# Altium project PROC154E3_SCH.PrjPcb (part 30 of 60)

## Sheet 32. USB 3.0 TYPE A CONN#1.SchDoc: USB 3.0 TYPE-A CONNECTORS - 1
size 513 x 386 mm; Project: PROC154E2(001)_SK_AM69; Issue: 1.0; RevCode: E3; Page Create Date: March  8, 1995; Variant Name: Core Design; Schematic Page Number: 32; Page Number: 32; Page Size: C; Comment: MISTRAL_TITLEBLK_CSIZE_1; Page Count: 62; Schematic Page Count: 62; Name: PROC154E2 001 SK AM69; DsnPath: C:\Users\danie\Downloads\sprr466c\PROC154E3_RP\PROC154E3_SCH.DSN; SchematicName: SCHEMATIC1; PageName: 32. USB 3.0 TYPE A CONN#1; PageSize: C; TopSchematic: True
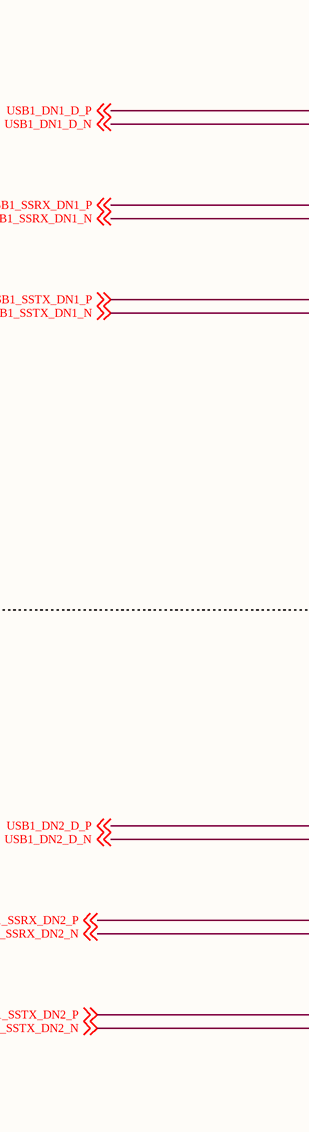
[diagram p51: 32. USB 3.0 TYPE A CONN#1.SchDoc, left]
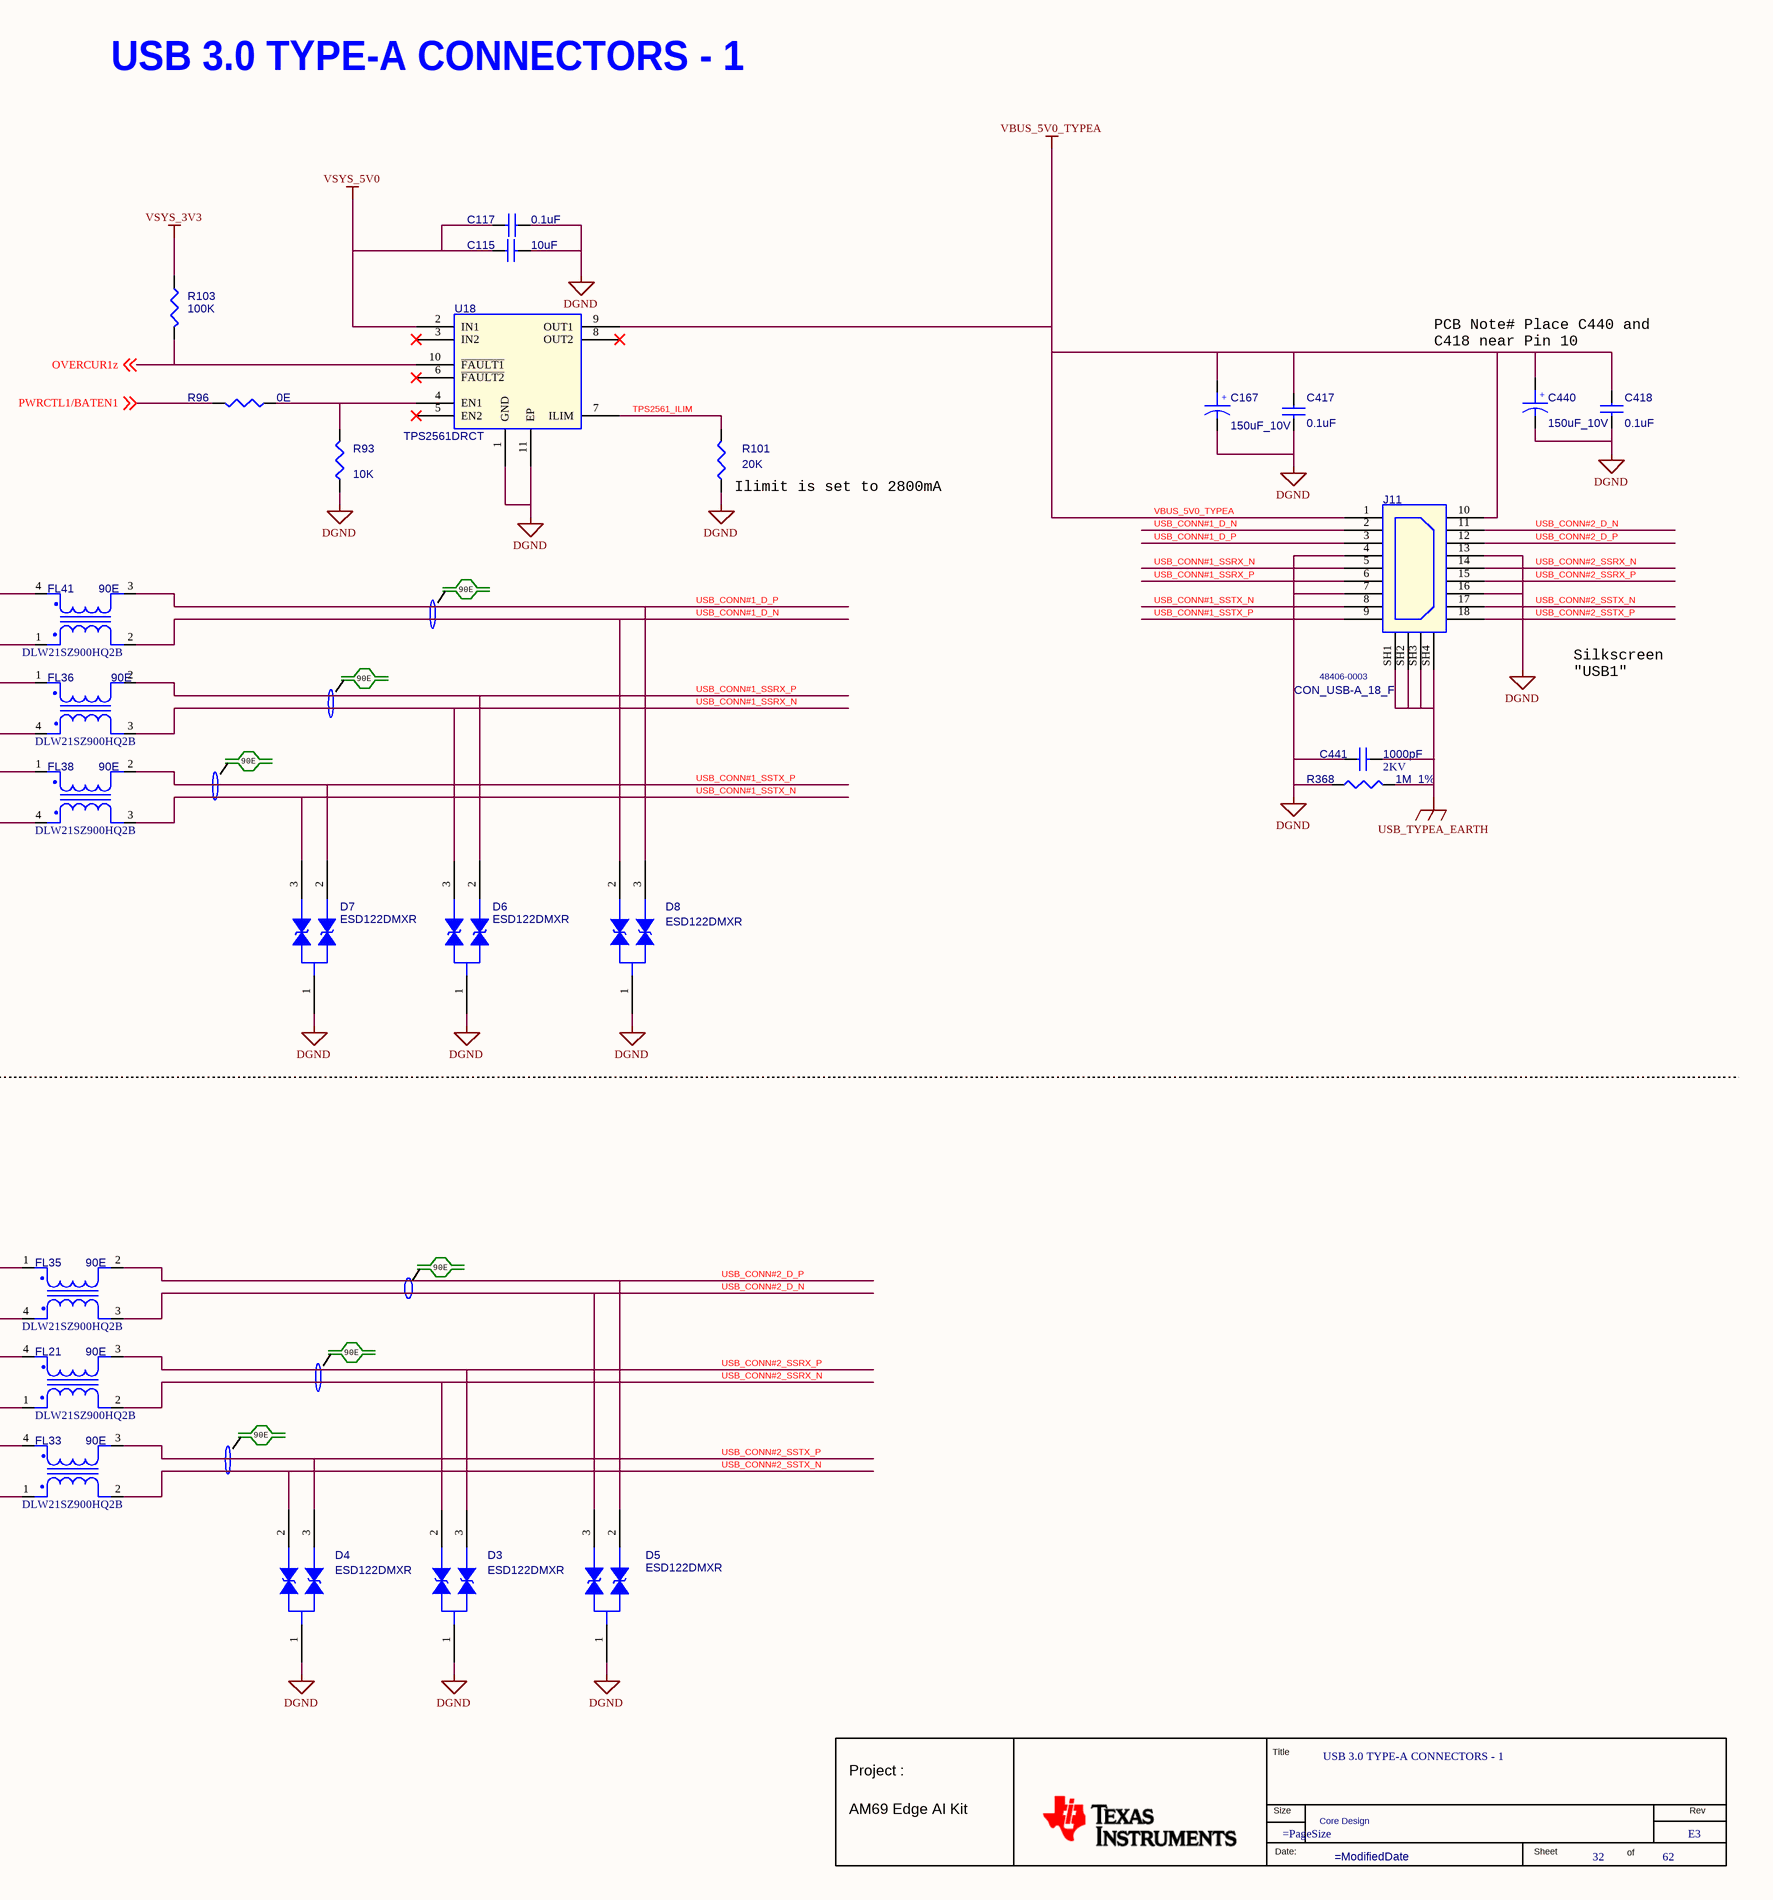
[diagram p52: 32. USB 3.0 TYPE A CONN#1.SchDoc, right]

### Parts
(Parts that share a designator on the sheet are numbered #1, #2 ... from top to bottom, then left to right.)
*#32  RevCode: E3  Title: USB 3.0 TYPE-A CONNECTORS - 1  Page Number: 32  Page Count: 62  Variant Name: Core Design  (hidden comment: MISTRAL_TITLEBLK_CSIZE_1)  (graphical)
C115  10uF  [CAP0603_1]
C117  0.1uF  [CAP0201_0-5]
C167  150uF_10V  [CAPT3528B_2-25]
C417  0.1uF  [CAP0201_0-5]
C418  0.1uF  [CAP0201_0-5]
C440  150uF_10V  [CAPT3528B_2-25]
C441  1000pF  Voltage: 2KV  [CAP1206_1-5]
D3  ESD122DMXR  [X2SON3_ESD122DMX_30X40_0-4]
D4  ESD122DMXR  [X2SON3_ESD122DMX_30X40_0-4]
D5  ESD122DMXR  [X2SON3_ESD122DMX_30X40_0-4]
D6  ESD122DMXR  [X2SON3_ESD122DMX_30X40_0-4]
D7  ESD122DMXR  [X2SON3_ESD122DMX_30X40_0-4]
D8  ESD122DMXR  [X2SON3_ESD122DMX_30X40_0-4]
FL21  90E  Mfr_part_number: DLW21SZ900HQ2B  [IND4_DLW21H_90X60_SMD_1-4]
FL33  90E  Mfr_part_number: DLW21SZ900HQ2B  [IND4_DLW21H_90X60_SMD_1-4]
FL35  90E  Mfr_part_number: DLW21SZ900HQ2B  [IND4_DLW21H_90X60_SMD_1-4]
FL36  90E  Mfr_part_number: DLW21SZ900HQ2B  [IND4_DLW21H_90X60_SMD_1-4]
FL38  90E  Mfr_part_number: DLW21SZ900HQ2B  [IND4_DLW21H_90X60_SMD_1-4]
FL41  90E  Mfr_part_number: DLW21SZ900HQ2B  [IND4_DLW21H_90X60_SMD_1-4]
J11  CON_USB-A_18_F  Mfr_part_number: 48406-0003  [CON_USBA18_48406_S_R_T_15-7]
R93  10K  [RES0201_0-5]
R96  0E  [RES0402_0-5]
R101  20K  [RES0402_0-5]
R103  100K  [RES0402_0-5]
R368  1M_1%  [RES0805_0-75]
U18  TPS2561DRCT  [VSON10_TPS74801-Q1_120X120_1]

### Nets
DGND: C115.2 C117.1 C167.2 C417.2 C418.2 C440.2 C441.1 D3.1(GND) D4.1(GND) D5.1(GND) D6.1(GND) D7.1(GND) D8.1(GND) J11.4(GND_1) J11.7(GND_DRAIN_1) J11.13(GND_2) J11.16(GND_DRAIN_2) R93.1 R101.1 R368.1 U18.1(GND) U18.11(EP)  [project net VDD_CPU_HCPS_GOSNS]
USB_TYPEA_EARTH: C441.2 J11.SH1 J11.SH2 J11.SH3 J11.SH4 R368.2
VBUS_5V0_TYPEA: C167.1 C417.1 C418.1 C440.1 J11.1(VBUS_1) J11.10(VBUS_2) U18.9(OUT1)
VSYS_3V3: R103.1  [project net V_3V3]
VSYS_5V0: C115.1 C117.2 U18.2(IN1)
OVERCUR1z: R103.2 U18.10(~{FAULT1}) ; off-sheet OVERCUR1z
PWRCTL1/BATEN1: R96.2 ; off-sheet PWRCTL1/BATEN1
TPS2561_ILIM: R101.2 U18.7(ILIM)
USB1_DN1_D_N: FL41.1(IN1) ; off-sheet USB1_DN1_D_N
USB1_DN1_D_P: FL41.4(OUT2) ; off-sheet USB1_DN1_D_P
USB1_DN2_D_N: FL35.4(OUT2) ; off-sheet USB1_DN2_D_N
USB1_DN2_D_P: FL35.1(IN1) ; off-sheet USB1_DN2_D_P
USB1_SSRX_DN1_N: FL36.4(OUT2) ; off-sheet USB1_SSRX_DN1_N
USB1_SSRX_DN1_P: FL36.1(IN1) ; off-sheet USB1_SSRX_DN1_P
USB1_SSRX_DN2_N: FL21.1(IN1) ; off-sheet USB1_SSRX_DN2_N
USB1_SSRX_DN2_P: FL21.4(OUT2) ; off-sheet USB1_SSRX_DN2_P
USB1_SSTX_DN1_N: FL38.4(OUT2) ; off-sheet USB1_SSTX_DN1_N
USB1_SSTX_DN1_P: FL38.1(IN1) ; off-sheet USB1_SSTX_DN1_P
USB1_SSTX_DN2_N: FL33.1(IN1) ; off-sheet USB1_SSTX_DN2_N
USB1_SSTX_DN2_P: FL33.4(OUT2) ; off-sheet USB1_SSTX_DN2_P
USB_CONN#1_D_N: D8.2(IO1) FL41.2(IN2) J11.2(D-_1)
USB_CONN#1_D_P: D8.3(IO2) FL41.3(OUT1) J11.3(D+_1)
USB_CONN#1_SSRX_N: D6.3(IO2) FL36.3(OUT1) J11.5(STDA_SSRX-_1)
USB_CONN#1_SSRX_P: D6.2(IO1) FL36.2(IN2) J11.6(STDA_SSRX+_1)
USB_CONN#1_SSTX_N: D7.3(IO2) FL38.3(OUT1) J11.8(STDA_SSTX-_1)
USB_CONN#1_SSTX_P: D7.2(IO1) FL38.2(IN2) J11.9(STDA_SSTX+_1)
USB_CONN#2_D_N: D5.3(IO2) FL35.3(OUT1) J11.11(D-_2)
USB_CONN#2_D_P: D5.2(IO1) FL35.2(IN2) J11.12(D+_2)
USB_CONN#2_SSRX_N: D3.2(IO1) FL21.2(IN2) J11.14(STDA_SSRX-_2)
USB_CONN#2_SSRX_P: D3.3(IO2) FL21.3(OUT1) J11.15(STDA_SSRX+_2)
USB_CONN#2_SSTX_N: D4.2(IO1) FL33.2(IN2) J11.17(STDA_SSTX-_2)
USB_CONN#2_SSTX_P: D4.3(IO2) FL33.3(OUT1) J11.18(STDA_SSTX+_2)
NetR93_2: R93.2 R96.1 U18.4(EN1)

Not connected (* = marked no-connect by the designer): U18 3(IN2)* 5(EN2)* 6(~{FAULT2})* 8(OUT2)*

### Notes on the sheet
- USB 3.0 TYPE-A CONNECTORS - 1
- PCB Note# Place C440 and
  C418 near Pin 10
- (near R101) Ilimit is set to 2800mA
- 90E
- Silkscreen
  "USB1"
- (in symbol CAP_POL) +
- (in symbol MISTRAL_TITLEBLK_CSIZE_1) Title; Project :; Size; Rev; AM69 Edge AI Kit; Date:; Sheet; of

### Library data of the parts
*#32 = MISTRAL_TITLEBLK_CSIZE_1: as *#31 on sheet 31. USB HUB; Page Create Date: March  8, 1995; Page Size: =PageSize; Page Modify Date: =ModifiedDate; Schematic Page Count: 62; Schematic Page Number: 32
C115 = CAP_Dup1: CAP CERAMIC 10uF 16V 20% X6S 0603; Part Reference: C115; Mistral Part No: 120022090023-R; Mfr_name: TAIYO YUDEN; Mfr_part_number: EMK107BC6106MA-T; Part_type: CAPACITORS\CERAMIC; Project: J7AHP_SK_BRD; Wattage: NA; Customs_HS_Code: 85322990; Custom_Duty: 15%; Value: 10uF; PCB Footprint: CAP0603_1; Footprint Ref: CAP0603_1; Tolerance: 20%; Voltage: 16V; Package: 0603; Distributor_name: DIGIKEY; Distributor_part_number: 587-4867-1-ND; Library Ref: CAP; Height: 1.00MM; Weight: NA; Temperature: -55°C+105°C; Datasheet: Y:\MIS_DATABASE\DATASHEETS\CAPACITORS\EMK107BC6106MA-T.PDF; Crtd /date: PRAVEEN/160922; Chkd/date: PRAVEEN/160922; MECHANICAL 3D STEP FILE: CAP0603_1; Library Path: Y:\MIS_DATABASE\Library\ALTIUM_TOOL\SCHEMATICS_PARTS\MS_DISCRETE_Library.schlib; Footprint Path: Y:\MIS_DATABASE\Library\ALTIUM_TOOL\PCB_FOOTPRINTS\Altium_Footprint_Lib.PcbLib
C117 = CAP_Dup1: CAP CERAMIC 0.1uF 16V 10% X7S AUTO 0201; Part Reference: C117; Mistral Part No: 120021030007-R; Mfr_name: MURATA; Mfr_part_number: GRT033C71C104KE01D; Part_type: CAPACITORS\CERAMIC; Project: J7ES_SK_BRD; Wattage: NA; Customs_HS_Code: 85322990; Custom_Duty: 15%; Value: 0.1uF; PCB Footprint: CAP0201_0-5; Tolerance: 10%; Voltage: 16V; Package: 0201; Distributor_name: DIGIKEY; Distributor_part_number: 490-GRT033C71C104KE01DTR-ND; Height: 0.33MM; Weight: 330mg; Temperature: -55°C+125°C; Datasheet: Y:\MIS_DATABASE\DATASHEETS\CAPACITORS\GRT033C71C104KE01.PDF; Crtd /date: ALVY/110321; Chkd/date: MANIRAJA/110321; MECHANICAL 3D STEP FILE: CAP0201_0-5
C167 = CAP_POL: CAP TANTALUM 150uF 10V 20% ESR 500mE B3528; Part Reference: C167; Mistral Part No: 120015050001-R; Mfr_name: AVX CORPORATION; Mfr_part_number: TLJB157M010R0500; Part_type: CAPACITORS\TANTALUM; Project: MED CARD; Wattage: NA; Customs_HS_Code: 85322990; Custom_Duty: 15%; Value: 150uF_10V; Tolerance: 20%; Voltage: 10V; Package: B3528; Distributor_name: DIGIKEY; Distributor_part_number: 478-3349-1-ND; Library Ref: CAP_POL; Height: 2.10MM; Weight: NA; Temperature: -55°C+125°C; Datasheet: Y:\MIS_DATABASE\DATASHEETS\CAPACITORS\TLJ_SERIES.PDF; Crtd /date: VASANTHA/040515; Chkd/date: NAVEED/060515; MECHANICAL 3D STEP FILE: CAPT3528B_2-25; Footprint Ref: CAPT3528B_2-25; Library Path: Y:\MIS_DATABASE\Library\ALTIUM_TOOL\SCHEMATICS_PARTS\MS_DISCRETE_Library.schlib; Footprint Path: Y:\MIS_DATABASE\Library\ALTIUM_TOOL\PCB_FOOTPRINTS\Altium_Footprint_Lib.PcbLib; PCB Footprint: CAPT3528B_2-25
C417 = CAP_Dup1: CAP CERAMIC 0.1uF 16V 10% X7S AUTO 0201; Part Reference: C417; Mistral Part No: 120021030007-R; Mfr_name: MURATA; Mfr_part_number: GRT033C71C104KE01D; Part_type: CAPACITORS\CERAMIC; Project: J7ES_SK_BRD; Wattage: NA; Customs_HS_Code: 85322990; Custom_Duty: 15%; Value: 0.1uF; Tolerance: 10%; Voltage: 16V; Package: 0201; Distributor_name: DIGIKEY; Distributor_part_number: 490-GRT033C71C104KE01DTR-ND; Height: 0.33MM; Weight: 330mg; Temperature: -55°C+125°C; Datasheet: Y:\MIS_DATABASE\DATASHEETS\CAPACITORS\GRT033C71C104KE01.PDF; Crtd /date: ALVY/110321; Chkd/date: MANIRAJA/110321; MECHANICAL 3D STEP FILE: CAP0201_0-5; PCB Footprint: CAP0201_0-5
C418 = CAP_Dup1: CAP CERAMIC 0.1uF 16V 10% X7S AUTO 0201; Part Reference: C418; Mistral Part No: 120021030007-R; Mfr_name: MURATA; Mfr_part_number: GRT033C71C104KE01D; Part_type: CAPACITORS\CERAMIC; Project: J7ES_SK_BRD; Wattage: NA; Customs_HS_Code: 85322990; Custom_Duty: 15%; Value: 0.1uF; Tolerance: 10%; Voltage: 16V; Package: 0201; Distributor_name: DIGIKEY; Distributor_part_number: 490-GRT033C71C104KE01DTR-ND; Height: 0.33MM; Weight: 330mg; Temperature: -55°C+125°C; Datasheet: Y:\MIS_DATABASE\DATASHEETS\CAPACITORS\GRT033C71C104KE01.PDF; Crtd /date: ALVY/110321; Chkd/date: MANIRAJA/110321; MECHANICAL 3D STEP FILE: CAP0201_0-5; PCB Footprint: CAP0201_0-5
C440 = CAP_POL: CAP TANTALUM 150uF 10V 20% ESR 500mE B3528; Part Reference: C440; Part_type: CAPACITORS\TANTALUM; Mfr_part_number: TLJB157M010R0500; Mfr_name: AVX CORPORATION; Mistral Part No: 120015050001-R; Custom_Duty: 15%; Customs_HS_Code: 85322990; Wattage: NA; Project: MED CARD; Value: 150uF_10V; Footprint Path: Y:\MIS_DATABASE\Library\ALTIUM_TOOL\PCB_FOOTPRINTS\Altium_Footprint_Lib.PcbLib; Library Path: Y:\MIS_DATABASE\Library\ALTIUM_TOOL\SCHEMATICS_PARTS\MS_DISCRETE_Library.schlib; Footprint Ref: CAPT3528B_2-25; MECHANICAL 3D STEP FILE: CAPT3528B_2-25; Chkd/date: NAVEED/060515; Crtd /date: VASANTHA/040515; Datasheet: Y:\MIS_DATABASE\DATASHEETS\CAPACITORS\TLJ_SERIES.PDF; Temperature: -55°C+125°C; Weight: NA; Height: 2.10MM; Library Ref: CAP_POL; Distributor_part_number: 478-3349-1-ND; Distributor_name: DIGIKEY; Package: B3528; Voltage: 10V; Tolerance: 20%; PCB Footprint: CAPT3528B_2-25
C441 = CAP_Dup1: CAP CERAMIC 1000pF 2KV 10% X7R 1206; Part Reference: C441; Automotive Alternate_mfr_part_number: C1206X102KGRACAUTO; Automotive Alternate_mfr_name: KEMET; Direct Alternate_mfr_part_number: C1206C102KGRACTU; Part_type: CAPACITORS\CERAMIC; Mistral Part No: 120015110005-R; Wattage: NA; Custom_Duty: 15%; Customs_HS_Code: 85322990; Project: MANTIS_1.0_BRD; Value: 1000pF; Direct Alternate_mfr_name: KEMET; MECHANICAL 3D STEP FILE: CAP1206_1-5; Chkd/date: MANIRAJA/111219; Crtd /date: ALVY/111219; Datasheet: Y:\MIS_DATABASE\DATASHEETS\CAPACITORS\KEMET-C-X7R-HV.PDF; Temperature: -55°C+125°C; Weight: 16.2mg; Height: 1.35MM; Distributor_part_number: 399-4819-1-ND; Distributor_name: DIGIKEY; Package: 1206; Tolerance: 10%; Mfr_part_number: C1206C102KGRACTU; Mfr_name: KEMET; Library Ref: CAP; Footprint Ref: CAP1206_1-5; Library Path: Y:\MIS_DATABASE\Library\ALTIUM_TOOL\SCHEMATICS_PARTS\MS_DISCRETE_Library.schlib; Footprint Path: Y:\MIS_DATABASE\Library\ALTIUM_TOOL\PCB_FOOTPRINTS\Altium_Footprint_Lib.PcbLib; PCB Footprint: CAP1206_1-5
D3 = DIODE_ESD122DMXR: DIODE 2-CH ESD PROTECTION FOR USB TYPE-C AND HDMI 2.0 X2SON-3; Part Reference: D3; Part_type: DIODE\TVS; Mfr_name: TEXAS INSTRUMENTS; Mistral Part No: 130017080015-R; Custom_Duty: 15%; Customs_HS_Code: 85412900; Wattage: NA; Project: TI_SVB_CONTROLLER CARD; Value: ESD122DMXR; PCB Footprint: X2SON3_ESD122DMX_30X40_0-4; MECHANICAL 3D STEP FILE: X2SON3_ESD122DMX_30X40_0-4; Chkd/date: MANIRAJA/140817; Crtd /date: MANIRAJA/140817; Datasheet: Y:\MIS_DATABASE\DATASHEETS\DISCRETES\DIODES\ESD122XX.PDF; Temperature: -40°C+125°C; Weight: NA; Height: 0.40MM; Library Ref: DIODE_ESD122DMXR; Distributor_part_number: ESD122DMXR-ND; Distributor_name: DIGIKEY; Package: X2SON-3; Voltage: NA; Tolerance: NA; Mfr_part_number: ESD122DMXR
D4 = DIODE_ESD122DMXR: DIODE 2-CH ESD PROTECTION FOR USB TYPE-C AND HDMI 2.0 X2SON-3; Part Reference: D4; Mistral Part No: 130017080015-R; Mfr_name: TEXAS INSTRUMENTS; Part_type: DIODE\TVS; Project: TI_SVB_CONTROLLER CARD; Tolerance: NA; Customs_HS_Code: 85412900; Custom_Duty: 15%; Value: ESD122DMXR; PCB Footprint: X2SON3_ESD122DMX_30X40_0-4; Mfr_part_number: ESD122DMXR; Voltage: NA; Wattage: NA; Package: X2SON-3; Distributor_name: DIGIKEY; Distributor_part_number: ESD122DMXR-ND; Library Ref: DIODE_ESD122DMXR; Height: 0.40MM; Weight: NA; Temperature: -40°C+125°C; Datasheet: Y:\MIS_DATABASE\DATASHEETS\DISCRETES\DIODES\ESD122XX.PDF; Crtd /date: MANIRAJA/140817; Chkd/date: MANIRAJA/140817; MECHANICAL 3D STEP FILE: X2SON3_ESD122DMX_30X40_0-4
D5 = DIODE_ESD122DMXR: DIODE 2-CH ESD PROTECTION FOR USB TYPE-C AND HDMI 2.0 X2SON-3; Part Reference: D5; Part_type: DIODE\TVS; Mfr_name: TEXAS INSTRUMENTS; Mistral Part No: 130017080015-R; Custom_Duty: 15%; Customs_HS_Code: 85412900; Wattage: NA; Project: TI_SVB_CONTROLLER CARD; Value: ESD122DMXR; MECHANICAL 3D STEP FILE: X2SON3_ESD122DMX_30X40_0-4; Chkd/date: MANIRAJA/140817; Crtd /date: MANIRAJA/140817; Datasheet: Y:\MIS_DATABASE\DATASHEETS\DISCRETES\DIODES\ESD122XX.PDF; Temperature: -40°C+125°C; Weight: NA; Height: 0.40MM; Library Ref: DIODE_ESD122DMXR; Distributor_part_number: ESD122DMXR-ND; Distributor_name: DIGIKEY; Package: X2SON-3; Voltage: NA; Tolerance: NA; Mfr_part_number: ESD122DMXR; PCB Footprint: X2SON3_ESD122DMX_30X40_0-4
D6 = DIODE_ESD122DMXR: DIODE 2-CH ESD PROTECTION FOR USB TYPE-C AND HDMI 2.0 X2SON-3; Part Reference: D6; Mistral Part No: 130017080015-R; Mfr_name: TEXAS INSTRUMENTS; Part_type: DIODE\TVS; Project: TI_SVB_CONTROLLER CARD; Tolerance: NA; Customs_HS_Code: 85412900; Custom_Duty: 15%; Value: ESD122DMXR; Mfr_part_number: ESD122DMXR; Voltage: NA; Wattage: NA; Package: X2SON-3; Distributor_name: DIGIKEY; Distributor_part_number: ESD122DMXR-ND; Library Ref: DIODE_ESD122DMXR; Height: 0.40MM; Weight: NA; Temperature: -40°C+125°C; Datasheet: Y:\MIS_DATABASE\DATASHEETS\DISCRETES\DIODES\ESD122XX.PDF; Crtd /date: MANIRAJA/140817; Chkd/date: MANIRAJA/140817; MECHANICAL 3D STEP FILE: X2SON3_ESD122DMX_30X40_0-4; PCB Footprint: X2SON3_ESD122DMX_30X40_0-4
D7 = DIODE_ESD122DMXR: DIODE 2-CH ESD PROTECTION FOR USB TYPE-C AND HDMI 2.0 X2SON-3; Part Reference: D7; Part_type: DIODE\TVS; Mfr_name: TEXAS INSTRUMENTS; Mistral Part No: 130017080015-R; Custom_Duty: 15%; Customs_HS_Code: 85412900; Wattage: NA; Project: TI_SVB_CONTROLLER CARD; Value: ESD122DMXR; MECHANICAL 3D STEP FILE: X2SON3_ESD122DMX_30X40_0-4; Chkd/date: MANIRAJA/140817; Crtd /date: MANIRAJA/140817; Datasheet: Y:\MIS_DATABASE\DATASHEETS\DISCRETES\DIODES\ESD122XX.PDF; Temperature: -40°C+125°C; Weight: NA; Height: 0.40MM; Library Ref: DIODE_ESD122DMXR; Distributor_part_number: ESD122DMXR-ND; Distributor_name: DIGIKEY; Package: X2SON-3; Voltage: NA; Tolerance: NA; Mfr_part_number: ESD122DMXR; PCB Footprint: X2SON3_ESD122DMX_30X40_0-4
D8 = DIODE_ESD122DMXR: DIODE 2-CH ESD PROTECTION FOR USB TYPE-C AND HDMI 2.0 X2SON-3; Part Reference: D8; Part_type: DIODE\TVS; Mfr_name: TEXAS INSTRUMENTS; Mistral Part No: 130017080015-R; Custom_Duty: 15%; Customs_HS_Code: 85412900; Wattage: NA; Project: TI_SVB_CONTROLLER CARD; Value: ESD122DMXR; PCB Footprint: X2SON3_ESD122DMX_30X40_0-4; MECHANICAL 3D STEP FILE: X2SON3_ESD122DMX_30X40_0-4; Chkd/date: MANIRAJA/140817; Crtd /date: MANIRAJA/140817; Datasheet: Y:\MIS_DATABASE\DATASHEETS\DISCRETES\DIODES\ESD122XX.PDF; Temperature: -40°C+125°C; Weight: NA; Height: 0.40MM; Library Ref: DIODE_ESD122DMXR; Distributor_part_number: ESD122DMXR-ND; Distributor_name: DIGIKEY; Package: X2SON-3; Voltage: NA; Tolerance: NA; Mfr_part_number: ESD122DMXR
FL21 = INDUCTOR_DLW31S: IND COMMON MODE CHOKE 90E 280mA SMD; Part Reference: FL21; Mistral Part No: 130019060035-R; Mfr_name: MURATA; Project: TI_J7ES_CP; Tolerance: NA; Customs_HS_Code: 85437099; Custom_Duty: 24%; SIGNAL_MODEL: INDUCTOR_DLW31S_IND4_DLW21H_90X_90E; Value: 90E; PCB Footprint: IND4_DLW21H_90X60_SMD_1-4; Footprint Ref: IND4_DLW21H_90X60_SMD_1-4; Part_type: INDUCTOR; Voltage: NA; Wattage: NA; Package: SMD; Distributor_name: NA; Distributor_part_number: NA; Library Ref: INDUCTOR_DLW31S; Height: 1.40MM; Weight: 11mg; Temperature: -40°C+105°C; Datasheet: Y:\MIS_DATABASE\DATASHEETS\DISCRETES\INDUCTORS\DLW21SZ900HQ2B.PDF; Crtd /date: MANIRAJA/270619; Chkd/date: MANIRAJA/270619; MECHANICAL 3D STEP FILE: IND4_DLW21H_90X60_SMD_1-4; Library Path: Y:\MIS_DATABASE\Library\ALTIUM_TOOL\SCHEMATICS_PARTS\MS_DISCRETE_Library.schlib; Footprint Path: Y:\MIS_DATABASE\Library\ALTIUM_TOOL\PCB_FOOTPRINTS\Altium_Footprint_Lib.PcbLib
FL33 = INDUCTOR_DLW31S: IND COMMON MODE CHOKE 90E 280mA SMD; Part Reference: FL33; Mistral Part No: 130019060035-R; Mfr_name: MURATA; Project: TI_J7ES_CP; Tolerance: NA; Customs_HS_Code: 85437099; Custom_Duty: 24%; SIGNAL_MODEL: INDUCTOR_DLW31S_IND4_DLW21H_90X_90E; Value: 90E; PCB Footprint: IND4_DLW21H_90X60_SMD_1-4; Footprint Ref: IND4_DLW21H_90X60_SMD_1-4; Part_type: INDUCTOR; Voltage: NA; Wattage: NA; Package: SMD; Distributor_name: NA; Distributor_part_number: NA; Library Ref: INDUCTOR_DLW31S; Height: 1.40MM; Weight: 11mg; Temperature: -40°C+105°C; Datasheet: Y:\MIS_DATABASE\DATASHEETS\DISCRETES\INDUCTORS\DLW21SZ900HQ2B.PDF; Crtd /date: MANIRAJA/270619; Chkd/date: MANIRAJA/270619; MECHANICAL 3D STEP FILE: IND4_DLW21H_90X60_SMD_1-4; Library Path: Y:\MIS_DATABASE\Library\ALTIUM_TOOL\SCHEMATICS_PARTS\MS_DISCRETE_Library.schlib; Footprint Path: Y:\MIS_DATABASE\Library\ALTIUM_TOOL\PCB_FOOTPRINTS\Altium_Footprint_Lib.PcbLib
FL35 = INDUCTOR_DLW31S: IND COMMON MODE CHOKE 90E 280mA SMD; Part Reference: FL35; Mfr_name: MURATA; Mistral Part No: 130019060035-R; Custom_Duty: 24%; Customs_HS_Code: 85437099; Wattage: NA; Project: TI_J7ES_CP; SIGNAL_MODEL: INDUCTOR_DLW31S_IND4_DLW21H_90X_90E; Value: 90E; PCB Footprint: IND4_DLW21H_90X60_SMD_1-4; Footprint Path: Y:\MIS_DATABASE\Library\ALTIUM_TOOL\PCB_FOOTPRINTS\Altium_Footprint_Lib.PcbLib; Library Path: Y:\MIS_DATABASE\Library\ALTIUM_TOOL\SCHEMATICS_PARTS\MS_DISCRETE_Library.schlib; MECHANICAL 3D STEP FILE: IND4_DLW21H_90X60_SMD_1-4; Chkd/date: MANIRAJA/270619; Crtd /date: MANIRAJA/270619; Datasheet: Y:\MIS_DATABASE\DATASHEETS\DISCRETES\INDUCTORS\DLW21SZ900HQ2B.PDF; Temperature: -40°C+105°C; Weight: 11mg; Height: 1.40MM; Library Ref: INDUCTOR_DLW31S; Distributor_part_number: NA; Distributor_name: NA; Package: SMD; Voltage: NA; Tolerance: NA; Part_type: INDUCTOR; Footprint Ref: IND4_DLW21H_90X60_SMD_1-4
FL36 = INDUCTOR_DLW31S: IND COMMON MODE CHOKE 90E 280mA SMD; Part Reference: FL36; Mfr_name: MURATA; Mistral Part No: 130019060035-R; Custom_Duty: 24%; Customs_HS_Code: 85437099; Wattage: NA; Project: TI_J7ES_CP; SIGNAL_MODEL: INDUCTOR_DLW31S_IND4_DLW21H_90X_90E; Value: 90E; PCB Footprint: IND4_DLW21H_90X60_SMD_1-4; Footprint Path: Y:\MIS_DATABASE\Library\ALTIUM_TOOL\PCB_FOOTPRINTS\Altium_Footprint_Lib.PcbLib; Library Path: Y:\MIS_DATABASE\Library\ALTIUM_TOOL\SCHEMATICS_PARTS\MS_DISCRETE_Library.schlib; MECHANICAL 3D STEP FILE: IND4_DLW21H_90X60_SMD_1-4; Chkd/date: MANIRAJA/270619; Crtd /date: MANIRAJA/270619; Datasheet: Y:\MIS_DATABASE\DATASHEETS\DISCRETES\INDUCTORS\DLW21SZ900HQ2B.PDF; Temperature: -40°C+105°C; Weight: 11mg; Height: 1.40MM; Library Ref: INDUCTOR_DLW31S; Distributor_part_number: NA; Distributor_name: NA; Package: SMD; Voltage: NA; Tolerance: NA; Part_type: INDUCTOR; Footprint Ref: IND4_DLW21H_90X60_SMD_1-4
FL38 = INDUCTOR_DLW31S: IND COMMON MODE CHOKE 90E 280mA SMD; Part Reference: FL38; Mfr_name: MURATA; Mistral Part No: 130019060035-R; Custom_Duty: 24%; Customs_HS_Code: 85437099; Wattage: NA; Project: TI_J7ES_CP; SIGNAL_MODEL: INDUCTOR_DLW31S_IND4_DLW21H_90X_90E; Value: 90E; PCB Footprint: IND4_DLW21H_90X60_SMD_1-4; Footprint Path: Y:\MIS_DATABASE\Library\ALTIUM_TOOL\PCB_FOOTPRINTS\Altium_Footprint_Lib.PcbLib; Library Path: Y:\MIS_DATABASE\Library\ALTIUM_TOOL\SCHEMATICS_PARTS\MS_DISCRETE_Library.schlib; MECHANICAL 3D STEP FILE: IND4_DLW21H_90X60_SMD_1-4; Chkd/date: MANIRAJA/270619; Crtd /date: MANIRAJA/270619; Datasheet: Y:\MIS_DATABASE\DATASHEETS\DISCRETES\INDUCTORS\DLW21SZ900HQ2B.PDF; Temperature: -40°C+105°C; Weight: 11mg; Height: 1.40MM; Library Ref: INDUCTOR_DLW31S; Distributor_part_number: NA; Distributor_name: NA; Package: SMD; Voltage: NA; Tolerance: NA; Part_type: INDUCTOR; Footprint Ref: IND4_DLW21H_90X60_SMD_1-4
FL41 = INDUCTOR_DLW31S: IND COMMON MODE CHOKE 90E 280mA SMD; Part Reference: FL41; Mistral Part No: 130019060035-R; Mfr_name: MURATA; Project: TI_J7ES_CP; Tolerance: NA; Customs_HS_Code: 85437099; Custom_Duty: 24%; SIGNAL_MODEL: INDUCTOR_DLW31S_IND4_DLW21H_90X_90E; Value: 90E; PCB Footprint: IND4_DLW21H_90X60_SMD_1-4; Footprint Ref: IND4_DLW21H_90X60_SMD_1-4; Part_type: INDUCTOR; Voltage: NA; Wattage: NA; Package: SMD; Distributor_name: NA; Distributor_part_number: NA; Library Ref: INDUCTOR_DLW31S; Height: 1.40MM; Weight: 11mg; Temperature: -40°C+105°C; Datasheet: Y:\MIS_DATABASE\DATASHEETS\DISCRETES\INDUCTORS\DLW21SZ900HQ2B.PDF; Crtd /date: MANIRAJA/270619; Chkd/date: MANIRAJA/270619; MECHANICAL 3D STEP FILE: IND4_DLW21H_90X60_SMD_1-4; Library Path: Y:\MIS_DATABASE\Library\ALTIUM_TOOL\SCHEMATICS_PARTS\MS_DISCRETE_Library.schlib; Footprint Path: Y:\MIS_DATABASE\Library\ALTIUM_TOOL\PCB_FOOTPRINTS\Altium_Footprint_Lib.PcbLib
J11 = CON_USB-A_18_4SH: CON USB-A TYPE 18POS FEMALE RT TH; Part Reference: J11; Part_type: CONNECTOR\USB; Mfr_name: MOLEX; Mistral Part No: 150017040004-R; Custom_Duty: 24%; Customs_HS_Code: 85369090; Wattage: NA; Project: AU17; Value: CON_USB-A_18_F; MECHANICAL 3D STEP FILE: CON_USBA18_48406_S_R_T_15-7; Chkd/date: MANIRAJA/050417; Crtd /date: MANIRAJA/310317; Datasheet: Y:\MIS_DATABASE\DATASHEETS\CONNECTORS\48406.PDF; Temperature: -20°C+85°C; Weight: 5.45g; Height: 15.65MM; Library Ref: CON_USB-A_18_4SH; Distributor_part_number: WM10420-ND; Distributor_name: DIGIKEY; Package: THRU-HOLE; Voltage: NA; Tolerance: NA; PCB Footprint: CON_USBA18_48406_S_R_T_15-7
R93 = RESISTOR_Dup2: RES 10K 1/20W 5% 0201; Part Reference: R93; Mistral Part No: 110010070051-R; Mfr_name: YAGEO AMERICA; Mfr_part_number: RC0201JR-0710KL; Part_type: RESISTORS\FIXED; Project: GOLDEN-I LITE; Voltage: NA; Customs_HS_Code: 85332119; Custom_Duty: 15%; Value: 10K; PCB Footprint: RES0201_0-5; Footprint Path: Y:\MIS_DATABASE\Library\ALTIUM_TOOL\PCB_FOOTPRINTS\Altium_Footprint_Lib.PcbLib; Library Path: Y:\MIS_DATABASE\Library\ALTIUM_TOOL\SCHEMATICS_PARTS\MS_DISCRETE_Library.schlib; Footprint Ref: RES0201_0-5; Library Ref: RESISTOR; Tolerance: 5%; Wattage: 1/20W; Package: 0201; Distributor_name: DIGIKEY; Distributor_part_number: 311-10KNCT-ND; Height: 0.26MM; Weight: 0.17mg; Temperature: -55°C+125°C; Datasheet: Y:\MIS_DATABASE\DATASHEETS\RESISTORS\RCXXXXL-SER_MAR18.PDF; Crtd /date: MANIRAJA/050517; Chkd/date: MANIRAJA/050517; MECHANICAL 3D STEP FILE: RES0201_0-5
R96 = RESISTOR_Dup2: RES 0E 1/10W JUMPER 0402; Part Reference: R96; Part_type: RESISTORS\FIXED; Mfr_part_number: ERJ-2GE0R00X; Mfr_name: PANASONIC-ECG; Mistral Part No: 110018030052-R; Custom_Duty: 15%; Customs_HS_Code: 85332119; Voltage: NA; Project: AEGIS POM; Value: 0E; PCB Footprint: RES0402_0-5; Footprint Path: Y:\MIS_DATABASE\Library\ALTIUM_TOOL\PCB_FOOTPRINTS\Altium_Footprint_Lib.PcbLib; Library Path: Y:\MIS_DATABASE\Library\ALTIUM_TOOL\SCHEMATICS_PARTS\MS_DISCRETE_Library.schlib; Footprint Ref: RES0402_0-5; Library Ref: RESISTOR; Chkd/date: VASANTHA/061216; Crtd /date: NAVEED/201014; Datasheet: Y:\MIS_DATABASE\DATASHEETS\RESISTORS\PAN-ERJSER_NOV17.PDF; Temperature: -55°C+155°C; Weight: 0.8mg; Height: 0.40MM; Distributor_part_number: P0.0JCT-ND; Distributor_name: DIGIKEY; Package: 0402; Wattage: 1/10W; Tolerance: NA; MECHANICAL 3D STEP FILE: RES0402_0-5
R101 = RESISTOR_Dup2: RES 20K 1/10W 5% 0402; Part Reference: R101; Mistral Part No: 110009030481-R; Mfr_name: PANASONIC-ECG; Mfr_part_number: ERJ-2GEJ203X; Part_type: RESISTORS\FIXED; Project: G4SLIM; Voltage: NA; Customs_HS_Code: 85332119; Custom_Duty: 15%; Value: 20K; PCB Footprint: RES0402_0-5; Footprint Ref: RES0402_0-5; Tolerance: 5%; Wattage: 1/10W; Package: 0402; Distributor_name: DIGIKEY; Distributor_part_number: P20KJCT-ND; Library Ref: RESISTOR; Height: 0.40MM; Weight: 0.8mg; Temperature: -55°C+155°C; Datasheet: Y:\MIS_DATABASE\DATASHEETS\RESISTORS\PAN-ERJSER_NOV17.PDF; Crtd /date: MAZHAR/140505; Chkd/date: SHREESHAIL/121205; MECHANICAL 3D STEP FILE: RES0402_0-5; Library Path: Y:\MIS_DATABASE\Library\ALTIUM_TOOL\SCHEMATICS_PARTS\MS_DISCRETE_Library.schlib; Footprint Path: Y:\MIS_DATABASE\Library\ALTIUM_TOOL\PCB_FOOTPRINTS\Altium_Footprint_Lib.PcbLib
R103 = RESISTOR_Dup2: RES 100K 1/10W 5% 0402; Part Reference: R103; Part_type: RESISTORS\FIXED; Mfr_part_number: ERJ-2GEJ104X; Mfr_name: PANASONIC-ECG; Mistral Part No: 110009030177-R; Custom_Duty: 15%; Customs_HS_Code: 85332119; Voltage: NA; Project: RED EYE; Value: 100K; PCB Footprint: RES0402_0-5; Footprint Path: Y:\MIS_DATABASE\Library\ALTIUM_TOOL\PCB_FOOTPRINTS\Altium_Footprint_Lib.PcbLib; Library Path: Y:\MIS_DATABASE\Library\ALTIUM_TOOL\SCHEMATICS_PARTS\MS_DISCRETE_Library.schlib; MECHANICAL 3D STEP FILE: RES0402_0-5; Chkd/date: VASANTHA/291216; Crtd /date: GEETHA/190406; Datasheet: Y:\MIS_DATABASE\DATASHEETS\RESISTORS\PAN-ERJSER_NOV17.PDF; Temperature: -55°C+155°C; Weight: 0.8mg; Height: 0.40MM; Library Ref: RESISTOR; Distributor_part_number: P100KJCT-ND; Distributor_name: DIGIKEY; Package: 0402; Wattage: 1/10W; Tolerance: 5%; Footprint Ref: RES0402_0-5
R368 = RESISTOR_Dup2: RES 1M 1/8W 1% 0805; Part Reference: R368; Mistral Part No: 110014100002-R; Mfr_name: PANASONIC-ECG; Mfr_part_number: ERJ-6ENF1004V; Part_type: RESISTORS\FIXED; Project: HUMANWARE_PHOENIX; Voltage: NA; Customs_HS_Code: 85332119; Custom_Duty: 15%; Value: 1M_1%; Footprint Ref: RES0805_0-75; Tolerance: 1%; Wattage: 1/8W; Package: 0805; Distributor_name: DIGIKEY; Distributor_part_number: P1.00MCCT-ND; Library Ref: RESISTOR; Height: 0.70MM; Weight: 4mg; Temperature: -55°C+155°C; Datasheet: Y:\MIS_DATABASE\DATASHEETS\RESISTORS\PAN-ERJSER_NOV17.PDF; Crtd /date: BALACHANDAR/150514; Chkd/date: VASANTHA/150514; MECHANICAL 3D STEP FILE: RES0805_0-75; Library Path: Y:\MIS_DATABASE\Library\ALTIUM_TOOL\SCHEMATICS_PARTS\MS_DISCRETE_Library.schlib; Footprint Path: Y:\MIS_DATABASE\Library\ALTIUM_TOOL\PCB_FOOTPRINTS\Altium_Footprint_Lib.PcbLib; PCB Footprint: RES0805_0-75
U18 = TPS2561_VSON10: IC DUAL CHANNEL PRECISION ADJ CURRENT-LIMITED POWER SWITCH VSON10; Part Reference: U18; Part_type: ICS\POWER\MANAGEMENT; Mfr_name: TEXAS INSTRUMENTS; Mistral Part No: 142021010010-R; Custom_Duty: 15%; Customs_HS_Code: 85423100; Wattage: NA; Project: TI_DRA821 SK EVM BRD; Value: TPS2561DRCT; PCB Footprint: VSON10_TPS74801-Q1_120X120_1; Footprint Path: Y:\MIS_DATABASE\Library\ALTIUM_TOOL\PCB_FOOTPRINTS\Altium_Footprint_Lib.PcbLib; Library Path: Y:\MIS_DATABASE\Library\ALTIUM_TOOL\SCHEMATICS_PARTS\MS_MISCPOWER_Library.schlib; MECHANICAL 3D STEP FILE: VSON10_TPS74801-Q1_120X120_1; Chkd/date: MANIRAJA/180121; Crtd /date: ALVY/180121; Datasheet: Y:\MIS_DATABASE\DATASHEETS\ICS\POWER\TPS2561.PDF; Temperature: -40°C+85°C; Weight: 39.3mg; Height: 1.00MM; Library Ref: TPS2561_VSON10; Distributor_part_number: 296-25548-1-ND; Distributor_name: DIGIKEY; Package: VSON10; Voltage: NA; Tolerance: NA; Mfr_part_number: TPS2561DRCT; Footprint Ref: VSON10_TPS74801-Q1_120X120_1

## Sheet 33. USB 3.0 TYPE A CONN#2.SchDoc: USB 3.0 TYPE-A CONNECTORS - 2
size 513 x 386 mm; Project: PROC154E2(001)_SK_AM69; Issue: 1.0; RevCode: E3; Page Create Date: March  8, 1995; Variant Name: Core Design; Schematic Page Number: 33; Page Number: 33; Page Size: C; Comment: MISTRAL_TITLEBLK_CSIZE_1; Page Count: 62; Schematic Page Count: 62; Name: PROC154E2 001 SK AM69; DsnPath: C:\Users\danie\Downloads\sprr466c\PROC154E3_RP\PROC154E3_SCH.DSN; SchematicName: SCHEMATIC1; PageName: 33. USB 3.0 TYPE A CONN#2; PageSize: C; TopSchematic: True
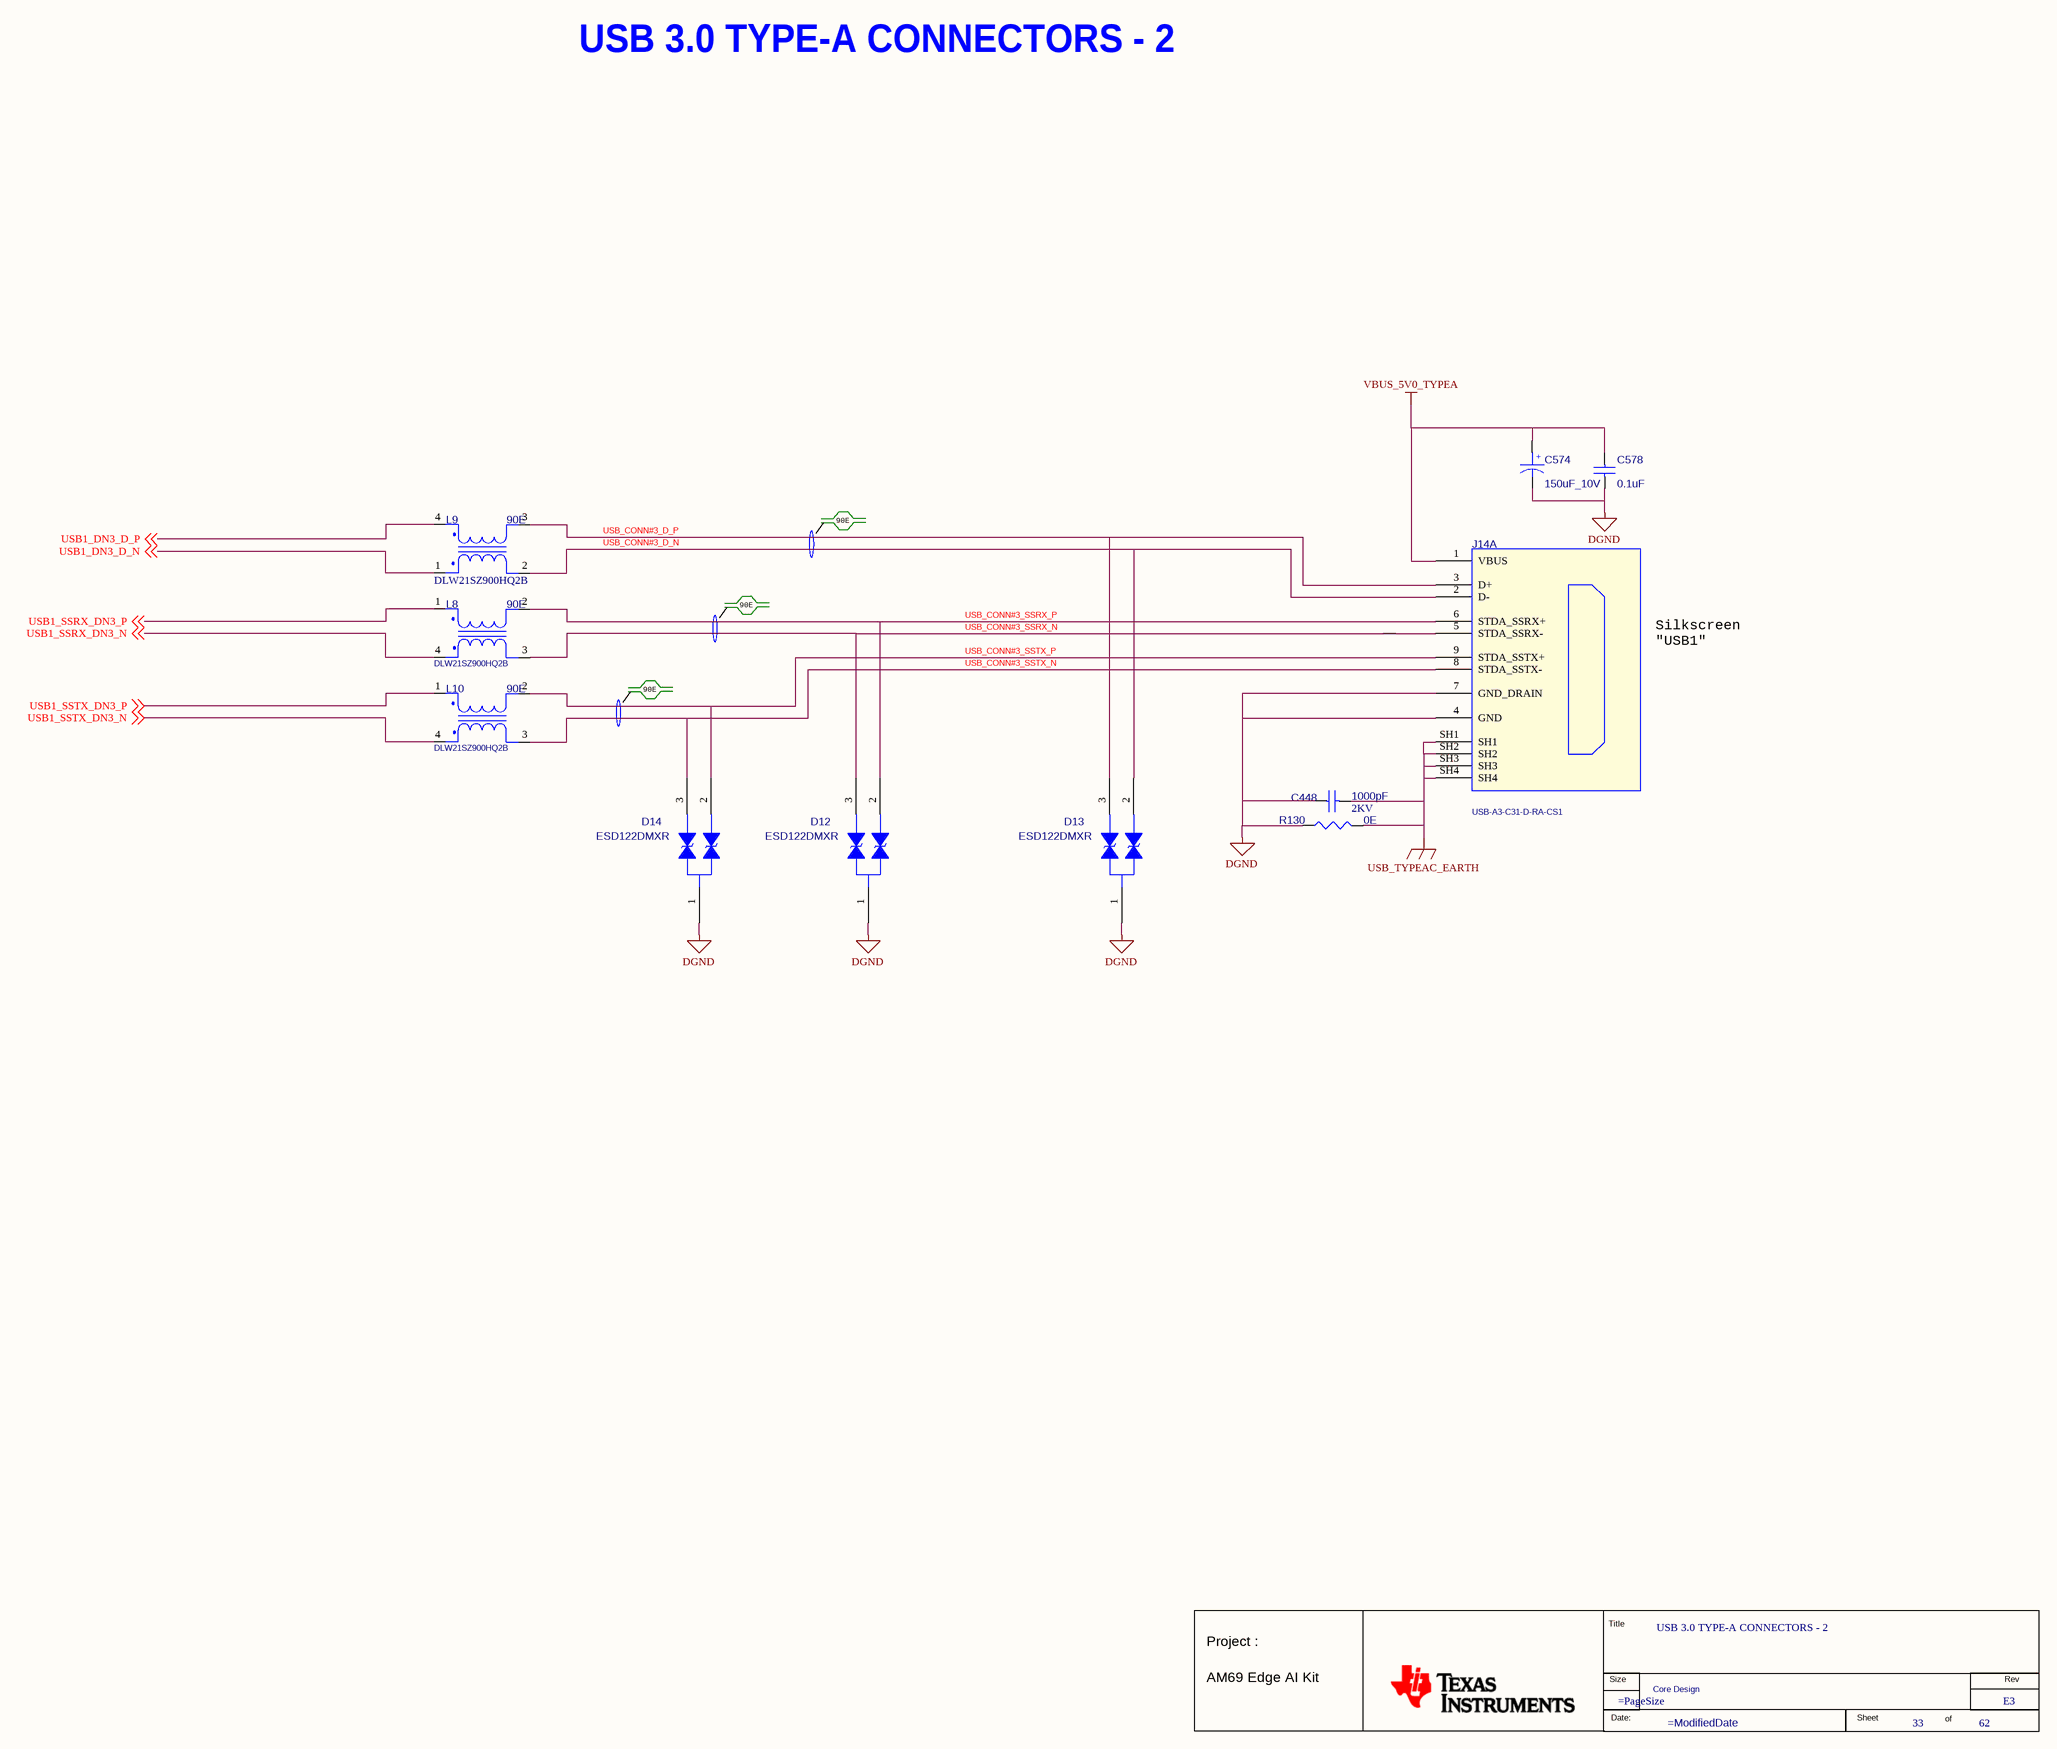
[diagram p53: 33. USB 3.0 TYPE A CONN#2.SchDoc]

### Parts
(Parts that share a designator on the sheet are numbered #1, #2 ... from top to bottom, then left to right.)
*#33  RevCode: E3  Title: USB 3.0 TYPE-A CONNECTORS - 2  Page Number: 33  Page Count: 62  Variant Name: Core Design  (hidden comment: MISTRAL_TITLEBLK_CSIZE_1)  (graphical)
C448  1000pF  Voltage: 2KV  [CAP1206_1-5]
C574  150uF_10V  [CAPT3528B_2-25]
C578  0.1uF  [CAP0201_0-5]
D12  ESD122DMXR  [X2SON3_ESD122DMX_30X40_0-4]
D13  ESD122DMXR  [X2SON3_ESD122DMX_30X40_0-4]
D14  ESD122DMXR  [X2SON3_ESD122DMX_30X40_0-4]
J14  Mfr_part_number: USB-A3-C31-D-RA-CS1  [CON_USBAC33_USB-A3-C31-D-RA-CS1_S_R_T_15-9]  (hidden comment: CON_USB-A9-C24_F)  (part A of 2)
L8  90E  Mfr_part_number: DLW21SZ900HQ2B  [IND4_DLW21H_90X60_SMD_1-4]
L9  90E  Mfr_part_number: DLW21SZ900HQ2B  [IND4_DLW21H_90X60_SMD_1-4]
L10  90E  Mfr_part_number: DLW21SZ900HQ2B  [IND4_DLW21H_90X60_SMD_1-4]
R130  0E  [RES0805_0-75]

### Nets
DGND: C448.1 C574.2 C578.2 D12.1(GND) D13.1(GND) D14.1(GND) J14.4(GND) J14.7(GND_DRAIN) R130.1  [project net VDD_CPU_HCPS_GOSNS]
USB_TYPEAC_EARTH: C448.2 J14.SH1 J14.SH2 J14.SH3 J14.SH4 R130.2
VBUS_5V0_TYPEA: C574.1 C578.1 J14.1(VBUS)
USB1_DN3_D_N: L9.1(IN1) ; off-sheet USB1_DN3_D_N
USB1_DN3_D_P: L9.4(OUT2) ; off-sheet USB1_DN3_D_P
USB1_SSRX_DN3_N: L8.4(OUT2) ; off-sheet USB1_SSRX_DN3_N
USB1_SSRX_DN3_P: L8.1(IN1) ; off-sheet USB1_SSRX_DN3_P
USB1_SSTX_DN3_N: L10.4(OUT2) ; off-sheet USB1_SSTX_DN3_N
USB1_SSTX_DN3_P: L10.1(IN1) ; off-sheet USB1_SSTX_DN3_P
USB_CONN#3_D_N: D13.2(IO1) J14.2(D-) L9.2(IN2)
USB_CONN#3_D_P: D13.3(IO2) J14.3(D+) L9.3(OUT1)
USB_CONN#3_SSRX_N: D12.3(IO2) J14.5(STDA_SSRX-) L8.3(OUT1)
USB_CONN#3_SSRX_P: D12.2(IO1) J14.6(STDA_SSRX+) L8.2(IN2)
USB_CONN#3_SSTX_N: D14.3(IO2) J14.8(STDA_SSTX-) L10.3(OUT1)
USB_CONN#3_SSTX_P: D14.2(IO1) J14.9(STDA_SSTX+) L10.2(IN2)

### Notes on the sheet
- USB 3.0 TYPE-A CONNECTORS - 2
- 90E
- Silkscreen
  "USB1"
- (in symbol CAP_POL) +
- (in symbol MISTRAL_TITLEBLK_CSIZE_1) Title; Project :; Size; Rev; AM69 Edge AI Kit; Date:; Sheet; of

### Library data of the parts
*#33 = MISTRAL_TITLEBLK_CSIZE_1: as *#31 on sheet 31. USB HUB; Page Create Date: March  8, 1995; Page Size: =PageSize; Page Modify Date: =ModifiedDate; Schematic Page Count: 62; Schematic Page Number: 33
C448 = CAP_Dup1: CAP CERAMIC 1000pF 2KV 10% X7R 1206; Part Reference: C448; Automotive Alternate_mfr_part_number: C1206X102KGRACAUTO; Automotive Alternate_mfr_name: KEMET; Direct Alternate_mfr_part_number: C1206C102KGRACTU; Part_type: CAPACITORS\CERAMIC; Mistral Part No: 120015110005-R; Wattage: NA; Custom_Duty: 15%; Customs_HS_Code: 85322990; Project: MANTIS_1.0_BRD; Value: 1000pF; PCB Footprint: CAP1206_1-5; Direct Alternate_mfr_name: KEMET; MECHANICAL 3D STEP FILE: CAP1206_1-5; Chkd/date: MANIRAJA/111219; Crtd /date: ALVY/111219; Datasheet: Y:\MIS_DATABASE\DATASHEETS\CAPACITORS\KEMET-C-X7R-HV.PDF; Temperature: -55°C+125°C; Weight: 16.2mg; Height: 1.35MM; Distributor_part_number: 399-4819-1-ND; Distributor_name: DIGIKEY; Package: 1206; Tolerance: 10%; Mfr_part_number: C1206C102KGRACTU; Mfr_name: KEMET; Library Ref: CAP; Footprint Ref: CAP1206_1-5; Library Path: Y:\MIS_DATABASE\Library\ALTIUM_TOOL\SCHEMATICS_PARTS\MS_DISCRETE_Library.schlib; Footprint Path: Y:\MIS_DATABASE\Library\ALTIUM_TOOL\PCB_FOOTPRINTS\Altium_Footprint_Lib.PcbLib
C574 = CAP_POL: CAP TANTALUM 150uF 10V 20% ESR 500mE B3528; Part Reference: C574; Mistral Part No: 120015050001-R; Mfr_name: AVX CORPORATION; Mfr_part_number: TLJB157M010R0500; Part_type: CAPACITORS\TANTALUM; Project: MED CARD; Wattage: NA; Customs_HS_Code: 85322990; Custom_Duty: 15%; Value: 150uF_10V; PCB Footprint: CAPT3528B_2-25; Tolerance: 20%; Voltage: 10V; Package: B3528; Distributor_name: DIGIKEY; Distributor_part_number: 478-3349-1-ND; Library Ref: CAP_POL; Height: 2.10MM; Weight: NA; Temperature: -55°C+125°C; Datasheet: Y:\MIS_DATABASE\DATASHEETS\CAPACITORS\TLJ_SERIES.PDF; Crtd /date: VASANTHA/040515; Chkd/date: NAVEED/060515; MECHANICAL 3D STEP FILE: CAPT3528B_2-25; Footprint Ref: CAPT3528B_2-25; Library Path: Y:\MIS_DATABASE\Library\ALTIUM_TOOL\SCHEMATICS_PARTS\MS_DISCRETE_Library.schlib; Footprint Path: Y:\MIS_DATABASE\Library\ALTIUM_TOOL\PCB_FOOTPRINTS\Altium_Footprint_Lib.PcbLib
C578 = CAP_Dup1: CAP CERAMIC 0.1uF 16V 10% X7S AUTO 0201; Part Reference: C578; Part_type: CAPACITORS\CERAMIC; Mfr_part_number: GRT033C71C104KE01D; Mfr_name: MURATA; Mistral Part No: 120021030007-R; Custom_Duty: 15%; Customs_HS_Code: 85322990; Wattage: NA; Project: J7ES_SK_BRD; Value: 0.1uF; PCB Footprint: CAP0201_0-5; MECHANICAL 3D STEP FILE: CAP0201_0-5; Chkd/date: MANIRAJA/110321; Crtd /date: ALVY/110321; Datasheet: Y:\MIS_DATABASE\DATASHEETS\CAPACITORS\GRT033C71C104KE01.PDF; Temperature: -55°C+125°C; Weight: 330mg; Height: 0.33MM; Distributor_part_number: 490-GRT033C71C104KE01DTR-ND; Distributor_name: DIGIKEY; Package: 0201; Voltage: 16V; Tolerance: 10%
D12 = DIODE_ESD122DMXR: DIODE 2-CH ESD PROTECTION FOR USB TYPE-C AND HDMI 2.0 X2SON-3; Part Reference: D12; Part_type: DIODE\TVS; Mfr_name: TEXAS INSTRUMENTS; Mistral Part No: 130017080015-R; Custom_Duty: 15%; Customs_HS_Code: 85412900; Wattage: NA; Project: TI_SVB_CONTROLLER CARD; Value: ESD122DMXR; MECHANICAL 3D STEP FILE: X2SON3_ESD122DMX_30X40_0-4; Chkd/date: MANIRAJA/140817; Crtd /date: MANIRAJA/140817; Datasheet: Y:\MIS_DATABASE\DATASHEETS\DISCRETES\DIODES\ESD122XX.PDF; Temperature: -40°C+125°C; Weight: NA; Height: 0.40MM; Library Ref: DIODE_ESD122DMXR; Distributor_part_number: ESD122DMXR-ND; Distributor_name: DIGIKEY; Package: X2SON-3; Voltage: NA; Tolerance: NA; Mfr_part_number: ESD122DMXR; PCB Footprint: X2SON3_ESD122DMX_30X40_0-4
D13 = DIODE_ESD122DMXR: DIODE 2-CH ESD PROTECTION FOR USB TYPE-C AND HDMI 2.0 X2SON-3; Part Reference: D13; Mistral Part No: 130017080015-R; Mfr_name: TEXAS INSTRUMENTS; Part_type: DIODE\TVS; Project: TI_SVB_CONTROLLER CARD; Tolerance: NA; Customs_HS_Code: 85412900; Custom_Duty: 15%; Value: ESD122DMXR; PCB Footprint: X2SON3_ESD122DMX_30X40_0-4; Mfr_part_number: ESD122DMXR; Voltage: NA; Wattage: NA; Package: X2SON-3; Distributor_name: DIGIKEY; Distributor_part_number: ESD122DMXR-ND; Library Ref: DIODE_ESD122DMXR; Height: 0.40MM; Weight: NA; Temperature: -40°C+125°C; Datasheet: Y:\MIS_DATABASE\DATASHEETS\DISCRETES\DIODES\ESD122XX.PDF; Crtd /date: MANIRAJA/140817; Chkd/date: MANIRAJA/140817; MECHANICAL 3D STEP FILE: X2SON3_ESD122DMX_30X40_0-4
D14 = DIODE_ESD122DMXR: DIODE 2-CH ESD PROTECTION FOR USB TYPE-C AND HDMI 2.0 X2SON-3; Part Reference: D14; Part_type: DIODE\TVS; Mfr_name: TEXAS INSTRUMENTS; Mistral Part No: 130017080015-R; Custom_Duty: 15%; Customs_HS_Code: 85412900; Wattage: NA; Project: TI_SVB_CONTROLLER CARD; Value: ESD122DMXR; MECHANICAL 3D STEP FILE: X2SON3_ESD122DMX_30X40_0-4; Chkd/date: MANIRAJA/140817; Crtd /date: MANIRAJA/140817; Datasheet: Y:\MIS_DATABASE\DATASHEETS\DISCRETES\DIODES\ESD122XX.PDF; Temperature: -40°C+125°C; Weight: NA; Height: 0.40MM; Library Ref: DIODE_ESD122DMXR; Distributor_part_number: ESD122DMXR-ND; Distributor_name: DIGIKEY; Package: X2SON-3; Voltage: NA; Tolerance: NA; Mfr_part_number: ESD122DMXR; PCB Footprint: X2SON3_ESD122DMX_30X40_0-4
J14 = CON_USB-A9-C24_F: CON USB-A TYPE 9POS AND USB-C TYPE 24POS STACKED FEMALE RT TH; Part Reference: J14; Part_type: CONNECTOR\USB; Mfr_name: ADAM TECH; Mistral Part No: 150021020043-R; Custom_Duty: 24%; Customs_HS_Code: 85369090; Wattage: NA; Project: J7ES_SK_BRD; Value: CON_USB-A9-C24_F; PCB Footprint: CON_USBAC33_USB-A3-C31-D-RA-CS1_S_R_T_15-9; Footprint Path: Y:\MIS_DATABASE\Library\ALTIUM_TOOL\PCB_FOOTPRINTS\Altium_Footprint_Lib.PcbLib; Library Path: Y:\MIS_DATABASE\Library\ALTIUM_TOOL\SCHEMATICS_PARTS\MS_CONNECTOR_Library.schlib; MECHANICAL 3D STEP FILE: CON_USBAC33_USB-A3-C31-D-RA-CS1_S_R_T_15-9; Chkd/date: MANIRAJA/110221; Crtd /date: ALVY/110221; Datasheet: Y:\MIS_DATABASE\DATASHEETS\CONNECTORS\USB-A3-C31-D-RA-CS1.PDF; Temperature: -30°C+85°C; Weight: NA; Height: 15.88MM; Footprint Ref: CON_USBAC33_USB-A3-C31-D-RA-CS1_S_R_T_15-9; Library Ref: CON_USB-A9-C24_F; Distributor_part_number: 2057-USB-A3-C31-D-RA-CS1-ND; Distributor_name: DIGIKEY; Package: THRU-HOLE; Voltage: NA; Tolerance: NA
L8 = INDUCTOR_DLW31S: IND COMMON MODE CHOKE 90E 280mA SMD; Part Reference: L8; Mfr_name: MURATA; Mistral Part No: 130019060035-R; Custom_Duty: 24%; Customs_HS_Code: 85437099; Wattage: NA; Project: TI_J7ES_CP; SIGNAL_MODEL: INDUCTOR_DLW31S_IND4_DLW21H_90X_90E; Value: 90E; PCB Footprint: IND4_DLW21H_90X60_SMD_1-4; Footprint Path: Y:\MIS_DATABASE\Library\ALTIUM_TOOL\PCB_FOOTPRINTS\Altium_Footprint_Lib.PcbLib; Library Path: Y:\MIS_DATABASE\Library\ALTIUM_TOOL\SCHEMATICS_PARTS\MS_DISCRETE_Library.schlib; MECHANICAL 3D STEP FILE: IND4_DLW21H_90X60_SMD_1-4; Chkd/date: MANIRAJA/270619; Crtd /date: MANIRAJA/270619; Datasheet: Y:\MIS_DATABASE\DATASHEETS\DISCRETES\INDUCTORS\DLW21SZ900HQ2B.PDF; Temperature: -40°C+105°C; Weight: 11mg; Height: 1.40MM; Library Ref: INDUCTOR_DLW31S; Distributor_part_number: NA; Distributor_name: NA; Package: SMD; Voltage: NA; Tolerance: NA; Part_type: INDUCTOR; Footprint Ref: IND4_DLW21H_90X60_SMD_1-4
L9 = INDUCTOR_DLW31S: IND COMMON MODE CHOKE 90E 280mA SMD; Part Reference: L9; Mistral Part No: 130019060035-R; Mfr_name: MURATA; Project: TI_J7ES_CP; Tolerance: NA; Customs_HS_Code: 85437099; Custom_Duty: 24%; SIGNAL_MODEL: INDUCTOR_DLW31S_IND4_DLW21H_90X_90E; Value: 90E; PCB Footprint: IND4_DLW21H_90X60_SMD_1-4; Footprint Ref: IND4_DLW21H_90X60_SMD_1-4; Part_type: INDUCTOR; Voltage: NA; Wattage: NA; Package: SMD; Distributor_name: NA; Distributor_part_number: NA; Library Ref: INDUCTOR_DLW31S; Height: 1.40MM; Weight: 11mg; Temperature: -40°C+105°C; Datasheet: Y:\MIS_DATABASE\DATASHEETS\DISCRETES\INDUCTORS\DLW21SZ900HQ2B.PDF; Crtd /date: MANIRAJA/270619; Chkd/date: MANIRAJA/270619; MECHANICAL 3D STEP FILE: IND4_DLW21H_90X60_SMD_1-4; Library Path: Y:\MIS_DATABASE\Library\ALTIUM_TOOL\SCHEMATICS_PARTS\MS_DISCRETE_Library.schlib; Footprint Path: Y:\MIS_DATABASE\Library\ALTIUM_TOOL\PCB_FOOTPRINTS\Altium_Footprint_Lib.PcbLib
L10 = INDUCTOR_DLW31S: IND COMMON MODE CHOKE 90E 280mA SMD; Part Reference: L10; Mfr_name: MURATA; Mistral Part No: 130019060035-R; Custom_Duty: 24%; Customs_HS_Code: 85437099; Wattage: NA; Project: TI_J7ES_CP; SIGNAL_MODEL: INDUCTOR_DLW31S_IND4_DLW21H_90X_90E; Value: 90E; PCB Footprint: IND4_DLW21H_90X60_SMD_1-4; Footprint Path: Y:\MIS_DATABASE\Library\ALTIUM_TOOL\PCB_FOOTPRINTS\Altium_Footprint_Lib.PcbLib; Library Path: Y:\MIS_DATABASE\Library\ALTIUM_TOOL\SCHEMATICS_PARTS\MS_DISCRETE_Library.schlib; MECHANICAL 3D STEP FILE: IND4_DLW21H_90X60_SMD_1-4; Chkd/date: MANIRAJA/270619; Crtd /date: MANIRAJA/270619; Datasheet: Y:\MIS_DATABASE\DATASHEETS\DISCRETES\INDUCTORS\DLW21SZ900HQ2B.PDF; Temperature: -40°C+105°C; Weight: 11mg; Height: 1.40MM; Library Ref: INDUCTOR_DLW31S; Distributor_part_number: NA; Distributor_name: NA; Package: SMD; Voltage: NA; Tolerance: NA; Part_type: INDUCTOR; Footprint Ref: IND4_DLW21H_90X60_SMD_1-4
R130 = RESISTOR_Dup2: RES 0E 1/8W 5% 0805; Part Reference: R130; Part_type: RESISTORS\FIXED; Mfr_part_number: RC0805JR-070RL; Mfr_name: YAGEO AMERICA; Mistral Part No: 110009030074-R; Custom_Duty: 15%; Customs_HS_Code: 85332119; Voltage: NA; Project: ZK_BIOMETRIC; Value: 0E; Footprint Path: Y:\MIS_DATABASE\Library\ALTIUM_TOOL\PCB_FOOTPRINTS\Altium_Footprint_Lib.PcbLib; Library Path: Y:\MIS_DATABASE\Library\ALTIUM_TOOL\SCHEMATICS_PARTS\MS_DISCRETE_Library.schlib; MECHANICAL 3D STEP FILE: RES0805_0-75; Chkd/date: VASANTHA/130416; Crtd /date: JEBRAN/020316; Datasheet: Y:\MIS_DATABASE\DATASHEETS\RESISTORS\RCXXXXL-SER_MAR18.PDF; Temperature: -55°C+155°C; Weight: 5.5mg; Height: 0.60MM; Library Ref: RESISTOR; Distributor_part_number: 311-0.0ARCT-ND; Distributor_name: DIGIKEY; Package: 0805; Wattage: 1/8W; Tolerance: 5%; Footprint Ref: RES0805_0-75; PCB Footprint: RES0805_0-75